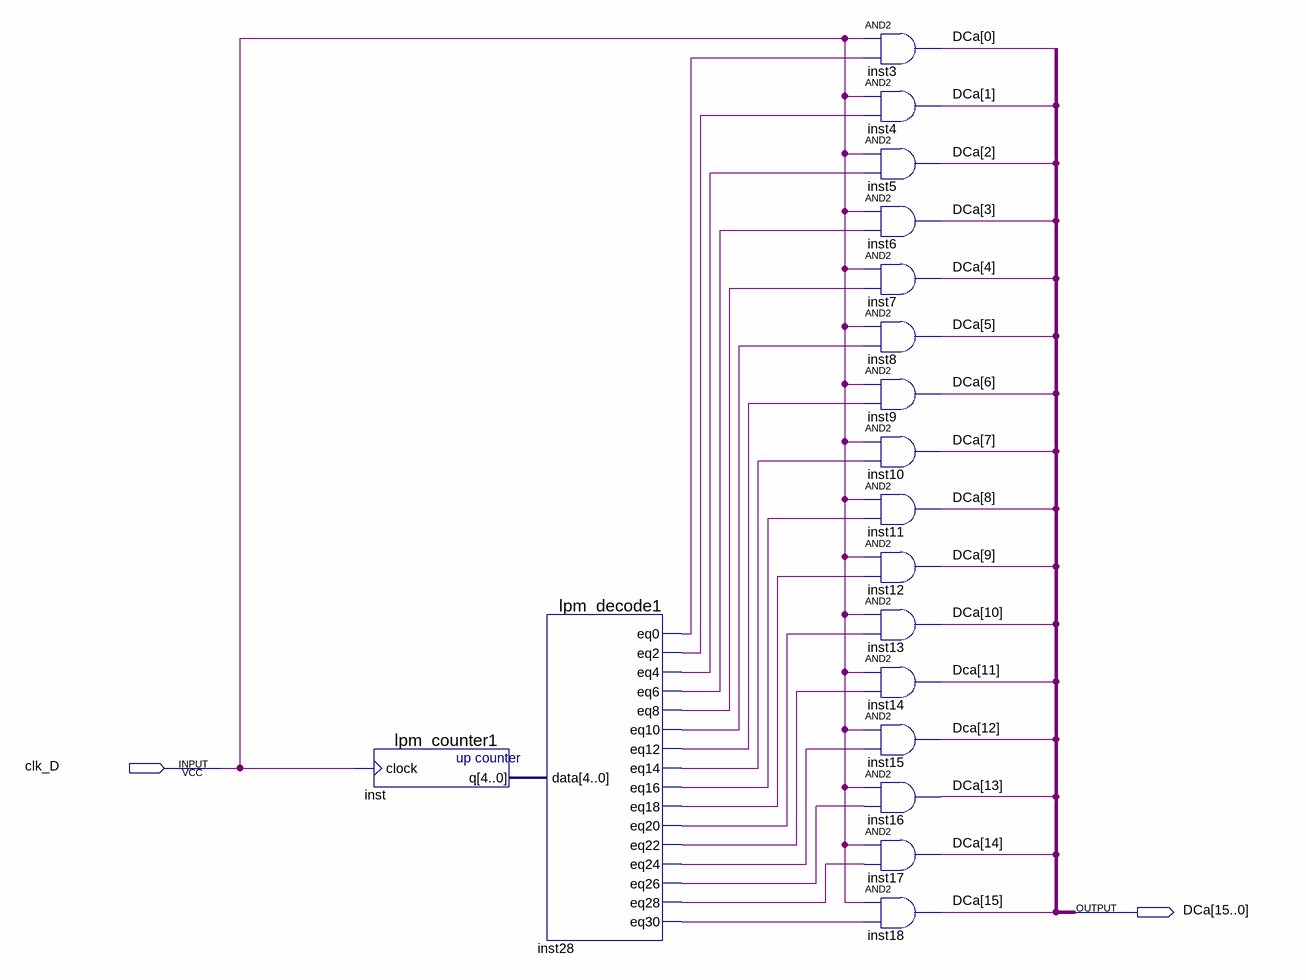
[diagram p0: schematic sheet]
// Quartus schematic Block3.bdf as structural Verilog: 18 symbols, 2 pins
module Block3 (
  input  clk_D,
  output [15:0] DCa
);

  wire inst28_eq0, inst28_eq2, inst28_eq4, inst28_eq6, inst28_eq8, inst28_eq10, inst28_eq12, inst28_eq14,
       inst28_eq16, inst28_eq18, inst28_eq20, inst28_eq22, inst28_eq24, inst28_eq26, inst28_eq28, inst28_eq30;
  wire [4:0] inst_q;

  lpm_counter1 inst (.clock(clk_D), .q(inst_q));
  lpm_decode1 inst28 (
    .data(inst_q), .eq0(inst28_eq0), .eq2(inst28_eq2), .eq4(inst28_eq4), .eq6(inst28_eq6), .eq8(inst28_eq8),
    .eq10(inst28_eq10), .eq12(inst28_eq12), .eq14(inst28_eq14), .eq16(inst28_eq16), .eq18(inst28_eq18),
    .eq20(inst28_eq20), .eq22(inst28_eq22), .eq24(inst28_eq24), .eq26(inst28_eq26), .eq28(inst28_eq28),
    .eq30(inst28_eq30));
  and inst3 (DCa[0], clk_D, inst28_eq0);
  and inst4 (DCa[1], clk_D, inst28_eq2);
  and inst5 (DCa[2], clk_D, inst28_eq4);
  and inst6 (DCa[3], clk_D, inst28_eq6);
  and inst7 (DCa[4], clk_D, inst28_eq8);
  and inst8 (DCa[5], clk_D, inst28_eq10);
  and inst9 (DCa[6], clk_D, inst28_eq12);
  and inst10 (DCa[7], clk_D, inst28_eq14);
  and inst11 (DCa[8], clk_D, inst28_eq16);
  and inst12 (DCa[9], clk_D, inst28_eq18);
  and inst13 (DCa[10], clk_D, inst28_eq20);
  and inst14 (DCa[11], clk_D, inst28_eq22);
  and inst15 (DCa[12], clk_D, inst28_eq24);
  and inst16 (DCa[13], clk_D, inst28_eq26);
  and inst17 (DCa[14], clk_D, inst28_eq28);
  and inst18 (DCa[15], clk_D, inst28_eq30);
endmodule
